# EAGLE design sensor-ds2406P+ (EAGLE 7.5.0)
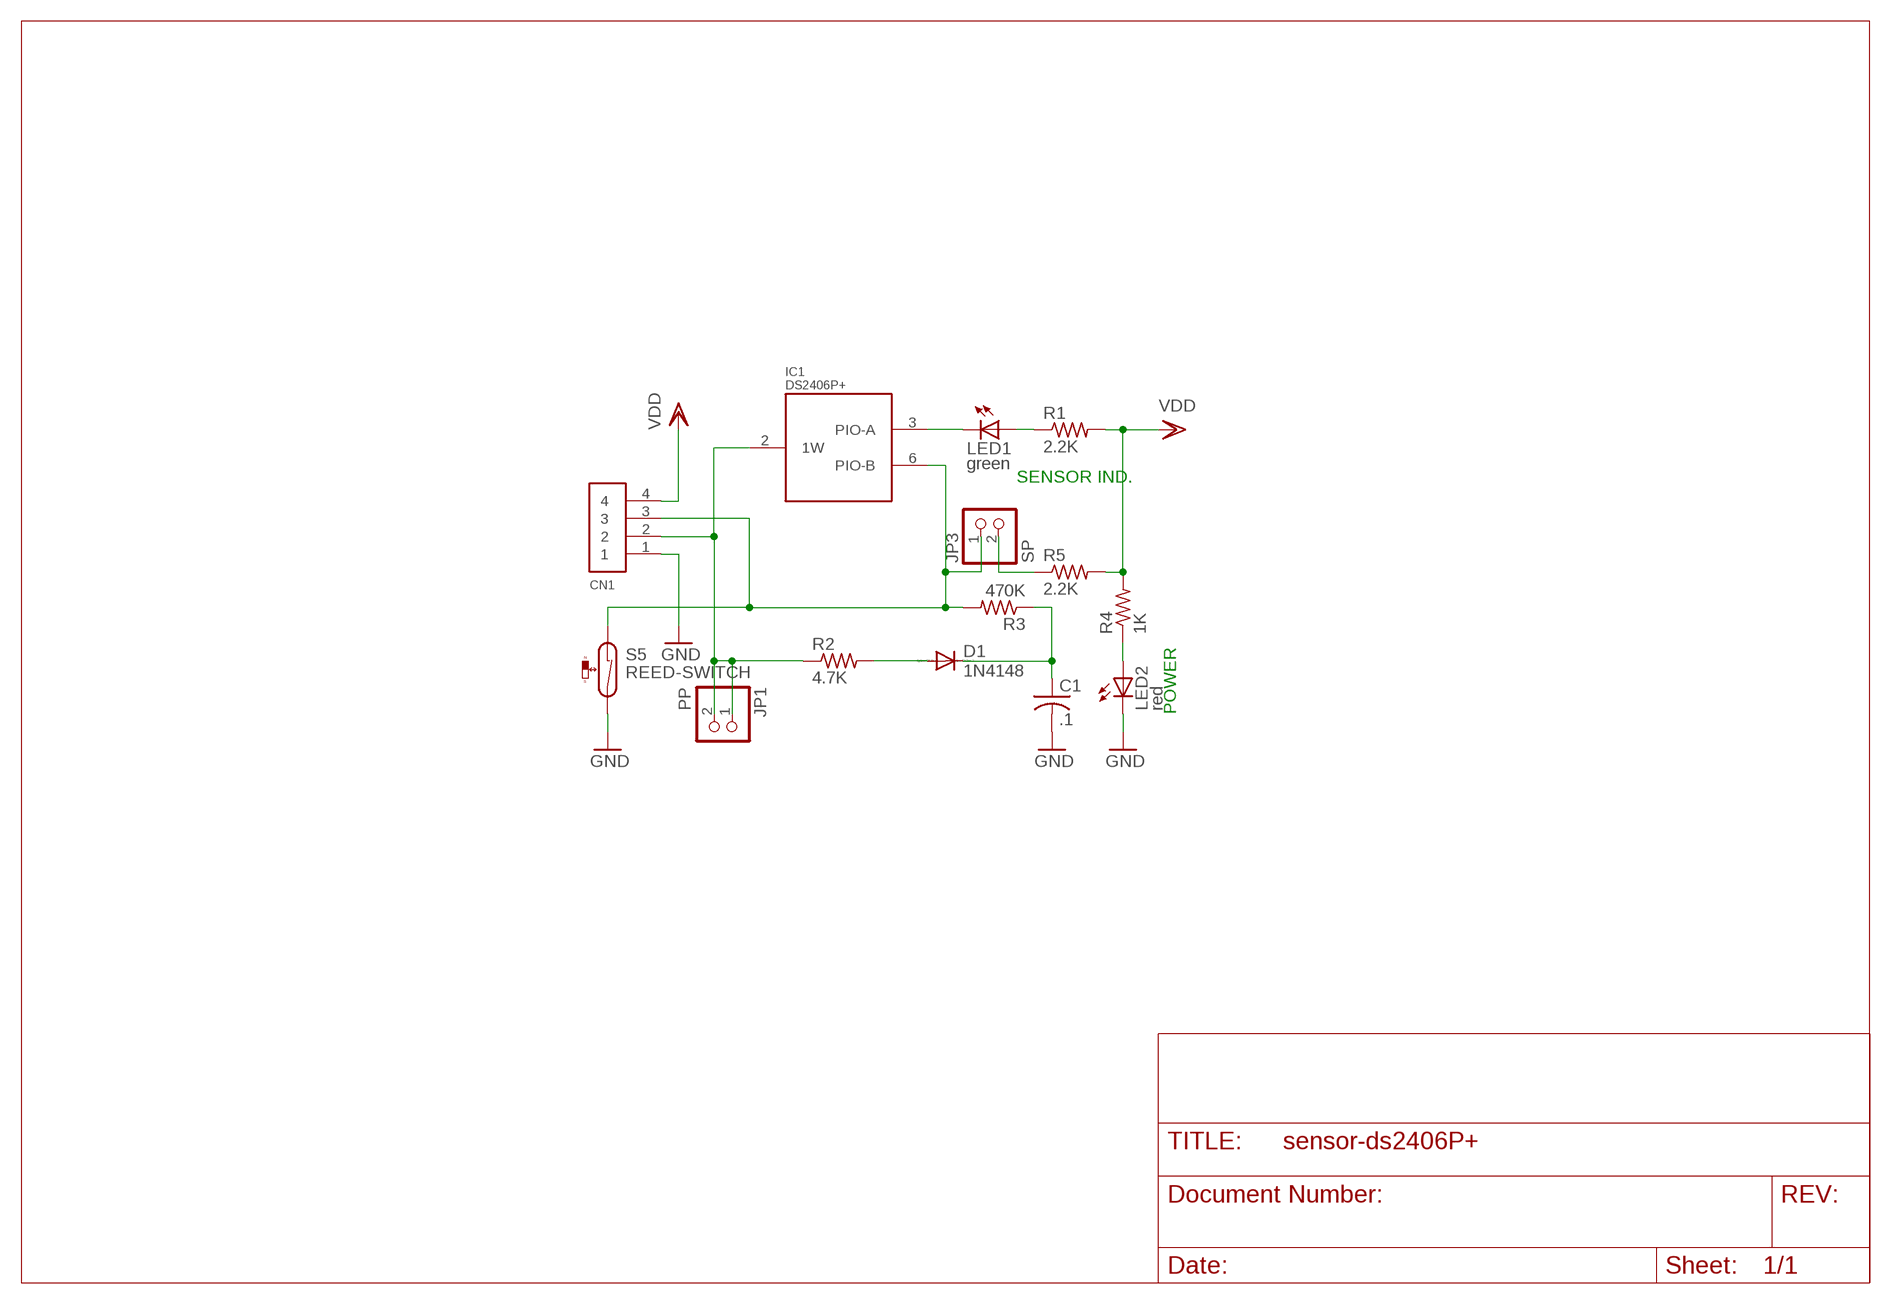
[diagram p0: schematic, sheet 1]

## Parts
C1  .1  C-USC0805K  [C0805K]
CN1  1X4-BIG  [1X04-BIG]
D1  1N4148  MMBF1N4148MMBD4148  [SOT23]
IC1  DS2406P+  [SO06]
JP1  PP  PINHD-1X2  [1X02]
JP3  SP  PINHD-1X2  [1X02]
LED1  green  LED3MM  [LED3MM]
LED2  red  LED3MM  [LED3MM]
R1  2.2K  R-US_R0805  [R0805]
R2  4.7K  R-US_R0805  [R0805]
R3  470K  R-US_R0805  [R0805]
R4  1K  R-US_R0805  [R0805]
R5  2.2K  R-US_R0805  [R0805]
S5  REED-SWITCH  REED-SWITCH-MK15-C2  [MK15]

## Nets
GND: C1.2 CN1.1 LED2.K(C) S5.2
IO: CN1.2 IC1.2(1W) JP1.1 JP1.2 R2.1
N$1: LED1.A R1.1
N$2: D1.1(A) R2.2
N$5: C1.1 D1.3(C) R3.1
N$6: LED2.A R4.1
N$7: JP3.2 R5.1
PIO$A: IC1.3(PIO-A) LED1.K(C)
PIO$B: CN1.3 IC1.6(PIO-B) JP3.1 R3.2 S5.1
VDD: CN1.4 R1.2 R4.2 R5.2

## Notes on the sheet
- SENSOR IND.
- POWER

## Power pins joined to a net without a drawn wire
GND: IC1.1(GND)
VDD: IC1.4(VDD)

## Library data of the parts
C1 = adafruit:C-US: CAPACITOR, American symbol
CN1 = adafruit:1X4: 4-pin connector
D1 = dont:MMBF1N4148: DIODE general purpose switching
IC1 = dont:DS2406P+: I2C to 1-Wire Host Adapter/Line Driver This device is a onewire host and I2C interface in one chip. It provides the complete DC/AC requirements for onewire communication, including overdrive speed mode, but, unlike the DS2480B chip, no 12V EPROM programming. Notes: For overdrive speed and 5V EEPROM programming, an external active pullup circuit must be connected to the 1W, VDD and PCT pin. See the datasheet for details. The lower two I2C adress bits of the chip can be selected by external pins, so up to 4 chips may be connected to the same I2C bus. Author: Orginal device and description from Giovanni Varasano <giovanni.varasano@fastwebnet.it> Improved by Jan Kandziora <jjj@gmx.de>
JP1 JP3 = pinhead:PINHD-1X2: PIN HEADER
LED1 LED2 = adafruit:LED: LED OSRAM: - CHIPLED LG R971, LG N971, LY N971, LG Q971, LY Q971, LO R971, LY R971 LH N974, LH R974 LS Q976, LO Q976, LY Q976 LO Q996 - Hyper CHIPLED LW Q18S LB Q993, LB Q99A, LB R99A - SideLED LS A670, LO A670, LY A670, LG A670, LP A670 LB A673, LV A673, LT A673, LW A673 LH A674 LY A675 LS A676, LA A676, LO A676, LY A676, LW A676 LS A679, LY A679, LG A679 - Hyper Micro SIDELED® LS Y876, LA Y876, LO Y876, LY Y876 LT Y87S - SmartLED LW L88C, LW L88S LB L89C, LB L89S, LG L890 LS L89K, LO L89K, LY L89K LS L896, LA L896, LO L896, LY L896 - TOPLED LS T670, LO T670, LY T670, LG T670, LP T670 LSG T670, LSP T670, LSY T670, LOP T670, LYG T670 LG T671, LOG T671, LSG T671 LB T673, LV T673, LT T673, LW T673 LH T674 LS T676, LA T676, LO T676, LY T676, LB T676, LH T676, LSB T676, LW T676 LB T67C, LV T67C, LT T67C, LS T67K, LO T67K, LY T67K, LW E67C LS E67B, LA E67B, LO E67B, LY E67B, LB E67C, LV E67C, LT E67C LW T67C LS T679, LY T679, LG T679 LS T770, LO T770, LY T770, LG T770, LP T770 LB T773, LV T773, LT T773, LW T773 LH T774 LS E675, LA E675, LY E675, LS T675 LS T776, LA T776, LO T776, LY T776, LB T776 LHGB T686 LT T68C, LB T68C - Hyper Mini TOPLED® LB M676 - Mini TOPLED Santana® LG M470 LS M47K, LO M47K, LY M47K Source: http://www.osram.convergy.de/
R1 R2 = rcl:R-US_: RESISTOR, American symbol
R3-R5 = resistor:R-US_: RESISTOR, American symbol
S5 = switch-reed:REED-SWITCH-: Reed Sensor; MF: MEDER; MPN: MK15-C-2; OC_FARNELL: 1079485

## Net classes
0 default: clearance 0.205 mm

## Board
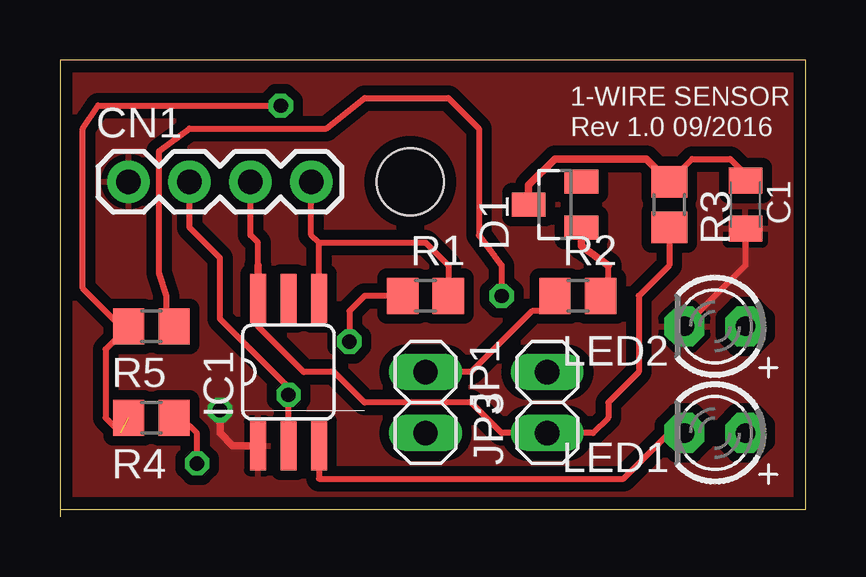
[diagram p1: board, top side]
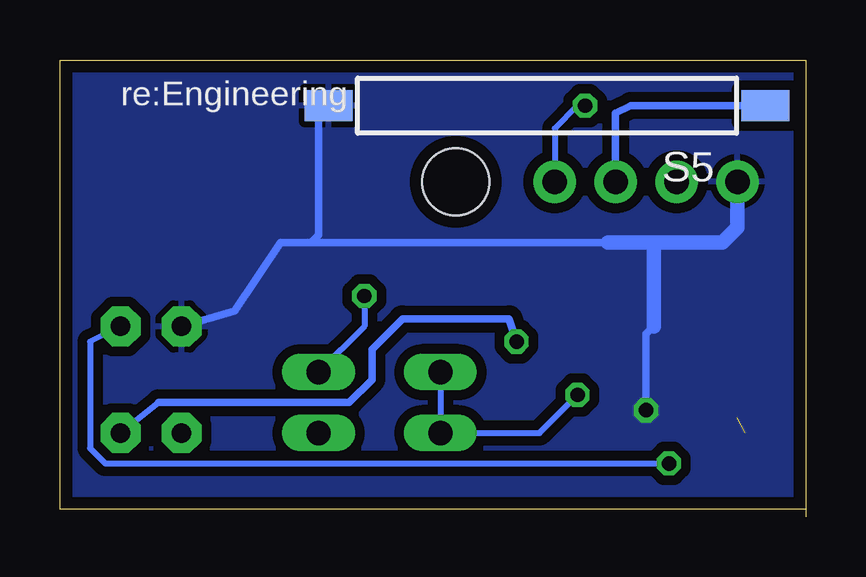
[diagram p2: board, bottom side, seen from below]

Size 31.1 x 19.06 mm. Coordinates in mm from the lower left corner, seen from the top.
Outline: 0,0.33 31.1,0.33 31.1,19.05 0,19.06 0,0
Copper layers (1*16): Top 0.035mm / dielectric 1.5mm / Bottom 0.035mm
Design rules "default *": minimum track width 10mil, minimum drill 12mil, track to track 8mil, track to pad 8mil, pad to pad 8mil, via to via 8mil, smd to smd 8mil, copper to edge 20mil, drill to drill 8mil, minimum pad ring 10mil, minimum via ring 8mil, stop-mask expansion 4mil, vias tented up to drill 0mil, thermal gap 10mil
Holes 2.8 mm at 14.61,13.98

### Footprints (pad centres in the part's own frame; a part is rotated, then mirrored left to right if it is on the bottom)
C0805K = smd 1.1 x 1.4: 1 -1,0; 2 1,0
1X04-BIG = drill 1.016 pad 1.778: 1 0,0; 2 2.54,0; 3 5.08,0; 4 7.62,0
SOT23 = smd 1 x 1.4: 1 -0.95,-1.1; 2 0.95,-1.1; 3 0,1.1
SO06 = smd 0.66 x 2.032: 1 -1.905,-3.073; 2 -0.635,-3.073; 3 0.635,-3.073; 4 0.635,3.073; 5 -0.635,3.073; 6 -1.905,3.073
1X02 = drill 1.016 long: 1 -1.27,0; 2 1.27,0
LED3MM = drill 0.813 pad 1.676 octagon: A -1.27,0; K 1.27,0
R0805 = smd 1.3 x 1.5: 1 -0.95,0; 2 0.95,0
MK15 = smd 2 x 1.3: 1 -9.1,0; 2 9.1,0

### Placement (x,y rotation side)
C1  28.57,13.03 270 top
CN1  2.86,13.98 0 top
D1  20.64,13.03 90 top
IC1  10.16,6.04 0 top
JP1  15.24,4.77 270 top
JP3  20.32,4.77 90 top
LED1  27.3,3.5 180 top
LED2  27.3,7.95 180 top
R1  15.24,9.22 0 top
R2  21.59,9.22 0 top
R3  25.4,13.03 270 top
R4  3.81,4.14 180 top
R5  3.81,7.95 180 top
S5  10.79,17.16 180 bottom

### Tracks (layer width: path | path; a pad name or v marks a point on that pad's centre or on a via)
GND  (via drill 0.6)
  Top 0.254: C1.2 28.57,10.49 LED2.K
  Top 0.305: IC1.1 7.2,2.97 6.67,3.5 v6.67,4.46
  Bottom 0.254: 8.26,11.44 3.49,11.44
  Bottom 0.305: v6.67,4.46 6.67,7.63 6.35,7.95 | LED2.K 23.81,8.58 21.91,11.44 20.64,11.44 | 20.64,11.44 8.26,11.44 | 20.64,11.44 20.32,11.76 20.32,17.37 S5.2
  Bottom 0.61: 6.35,11.44 3.49,11.44 2.86,12.08 CN1.1 | 6.35,7.95 6.35,11.44 | 8.26,11.44 6.35,11.44
  pour Top (isolate 0.406): 0,0.33 0,19.06 31.11,19.06 31.11,0.33
  pour Bottom (isolate 0.406): 0,0.33 0,19.06 31.11,19.06 31.11,0.33
IO  (via drill 0.6)
  Top 0.254: IC1.2 v9.53,5.09 9.53,5.41 6.67,8.27 6.67,10.8 5.4,12.08 CN1.2 | R2.1 20,8.58 19.68,8.58 17.14,6.04 JP1.1
  Bottom 0.254: JP1.1 JP1.2 11.11,3.5 v9.53,5.09
N$1  (via drill 0.6)
  Top 0.254: R1.1 12.7,9.22 12.06,8.58 v12.06,7.31
  Bottom 0.254: 26.99,4.77 LED1.A
  Bottom 0.305: 26.99,4.77 19.05,4.77 18.1,5.72 18.1,7 16.83,8.27 12.38,8.27 v12.06,7.31
N$2
  Top 0.254: R2.2 22.86,9.54 22.86,10.49
  Top 0.305: 22.86,10.49 21.74,11.29 D1.1
N$5
  Top 0.254: R3.1 26.36,14.93 27.94,14.93 28.57,14.3 C1.1
  Top 0.305: R3.1 24.45,14.93 20.64,14.93 19.54,13.83 D1.3
N$6  (via drill 0.6)
  Top 0.254: v5.71,2.23 5.71,3.5 5.08,4.14 R4.1
  Bottom 0.254: LED2.A 29.84,7.31 29.84,2.87 29.21,2.23 v5.71,2.23
N$7  (via drill 0.6)
  Top 0.254: R5.1 4.45,8.26 4.45,9.22 4.13,10.17 4.13,15.25 5.4,16.2 11.11,16.2 12.7,17.47 16.19,17.47 17.46,16.2 17.46,11.76 18.41,10.49 v18.41,9.22
  Bottom 0.254: v18.41,9.22 18.41,7.95 JP3.2
PIO$A
  Top 0.254: IC1.3 10.79,1.6 23.5,1.6 25.4,3.5 LED1.K
PIO$B
  Top 0.254: 8.26,9.85 8.26,7.95 10.16,6.04 11.43,6.04 12.7,4.77 17.14,4.77 18.41,3.5 JP3.1 22.23,3.5 22.86,4.14 22.86,4.77 24.13,6.04 24.13,9.22 25.4,10.49 R3.2 | 8.26,10.49 8.26,11.44 7.94,11.76 CN1.3
  Top 0.305: IC1.6 8.26,9.85 8.26,10.49
  Bottom 0.305: S5.1 7.3,17.16 7.94,16.84 CN1.3
VDD  (via drill 0.6)  (1 unrouted)
  Top 0.254: 3.17,3.5 2.54,3.5 1.91,4.14 1.91,6.99 R5.2 2.54,7.95 0.95,9.53 0.95,16.2 1.59,17.16 v9.21,17.16 | 10.79,11.44 10.48,11.76 CN1.4 | IC1.4 10.79,11.44 | 10.79,11.44 15.24,11.44 16.19,10.49 R1.2
  Bottom 0.254: v9.21,17.16 9.53,17.16 10.48,16.2 CN1.4

### Text on the board
tNames: 1-WIRE SENSOR | Rev 1.0 09/2016
bNames: re:Engineering
_bNames: S5